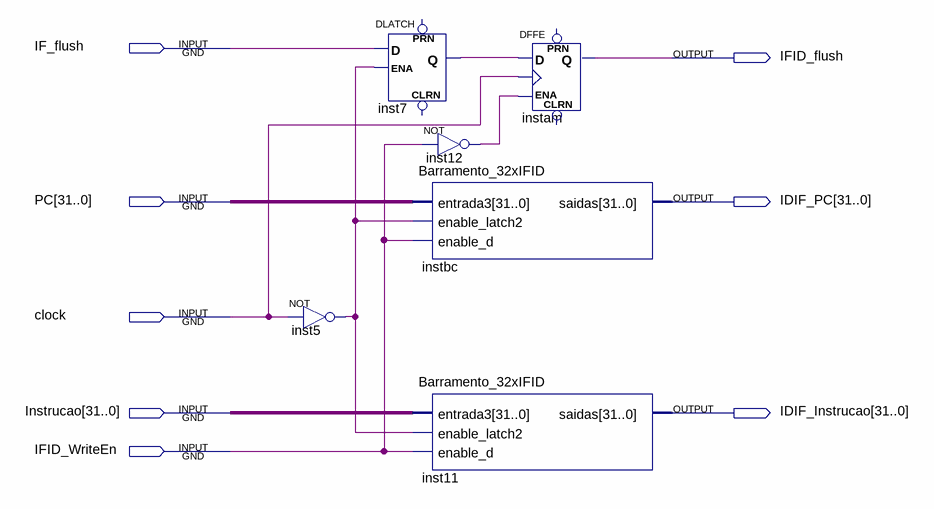
[diagram p0: schematic sheet]
// Quartus schematic IFID.bdf as structural Verilog: 6 symbols, 8 pins
module IFID (
  input  IF_flush,
  input  [31:0] PC,
  input  clock,
  input  [31:0] Instrucao,
  input  IFID_WriteEn,
  output IFID_flush,
  output [31:0] IDIF_PC,
  output [31:0] IDIF_Instrucao
);

  wire inst5_out, inst7_q, inst12_out;

  not inst5 (inst5_out, clock);
  DLATCH inst7 (.D(IF_flush), .ENA(inst5_out), .Q(inst7_q));  // open: CLRN, PRN
  not inst12 (inst12_out, IFID_WriteEn);
  Barramento_32xIFID instbc (.entrada3(PC), .enable_latch2(inst5_out), .enable_d(IFID_WriteEn), .saidas(IDIF_PC));
  Barramento_32xIFID inst11 (
    .entrada3(Instrucao), .enable_latch2(inst5_out), .enable_d(IFID_WriteEn), .saidas(IDIF_Instrucao));
  DFFE instam (.D(inst7_q), .CLK(clock), .ENA(inst12_out), .Q(IFID_flush));  // open: PRN, CLRN
endmodule
